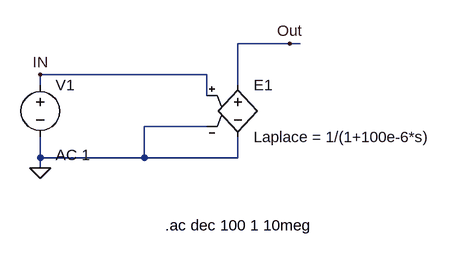
[diagram p0: schematic Draft2.asc]
Draft2.asc, the LTspice schematic file:
Version 4.1
SHEET 1 880 680
WIRE 352 64 272 64
WIRE 368 64 352 64
WIRE 224 112 -32 112
WIRE -32 128 -32 112
WIRE 272 128 272 64
WIRE 224 144 224 112
WIRE 224 192 128 192
WIRE -32 240 -32 208
WIRE 128 240 128 192
WIRE 128 240 -32 240
WIRE 272 240 272 208
WIRE 272 240 128 240
WIRE -32 256 -32 240
FLAG -32 256 0
FLAG 352 64 Out
FLAG -32 112 IN
SYMBOL e 272 112 R0
SYMATTR InstName E1
SYMATTR Value Laplace = 1/(1+100e-6*s)
SYMBOL voltage -32 112 R0
WINDOW 123 24 124 Left 2
WINDOW 39 0 0 Left 0
SYMATTR InstName V1
SYMATTR Value ""
SYMATTR Value2 AC 1
TEXT 160 344 Left 2 !.ac dec 100 1 10meg

The netlist it stands for:
* Draft2.asc
E1 Out 0 IN 0 Laplace = 1/(1+100e-6*s)
V1 IN 0 AC 1
.ac dec 100 1 10meg
.backanno
.end